# EAGLE design td1208-breakout3V3_v1.1 (EAGLE 7.2.0)
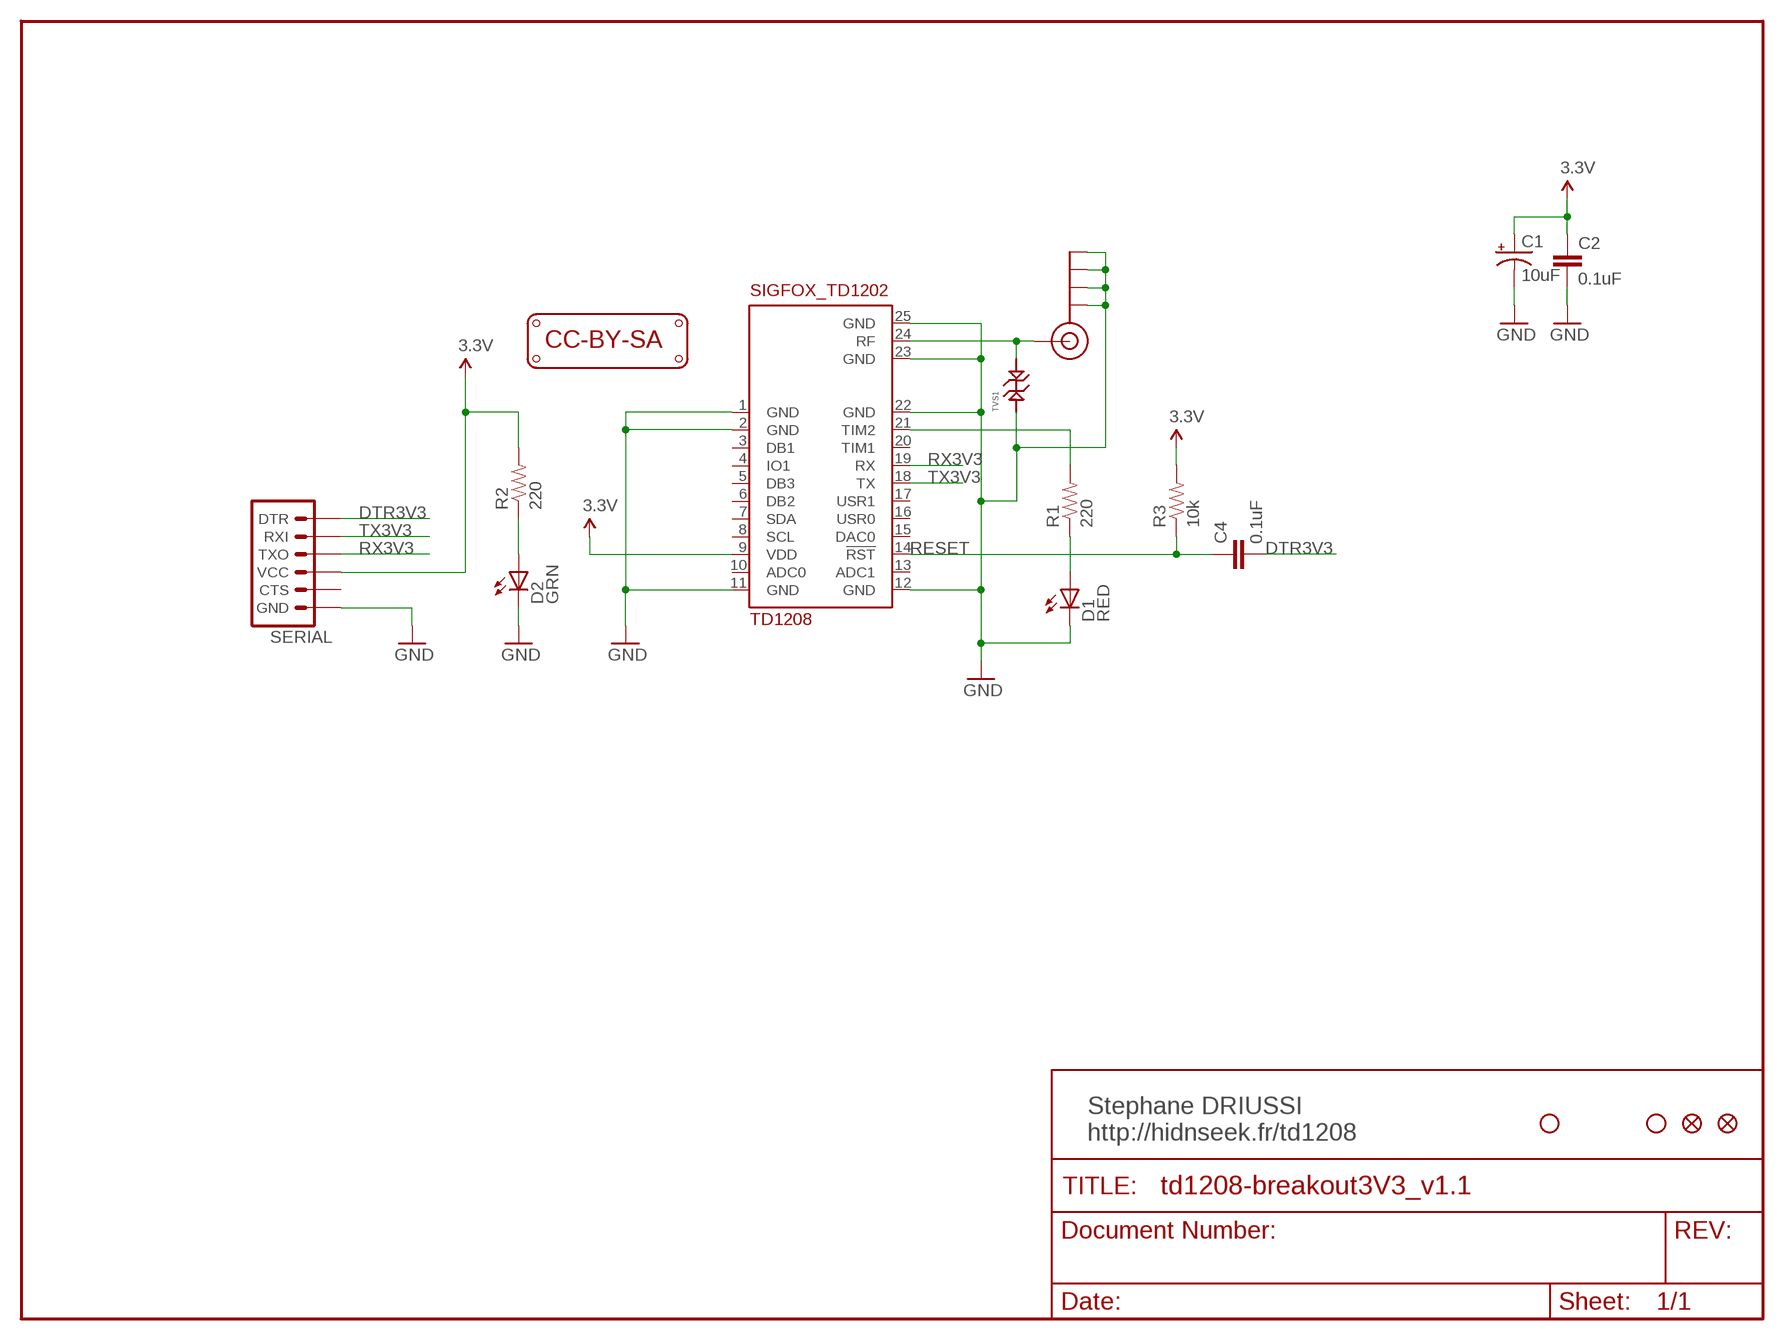
[diagram p0: schematic, sheet 1]

## Parts
C1  10uF  CAP_POL1206  [EIA3216]
C2  0.1uF  CAP0402-CAP  [0402-CAP]
C4  0.1uF  CAP0402-CAP  [0402-CAP]
D1  RED  LEDCHIP-LED0603  [CHIP-LED0603]
D2  GRN  LEDCHIP-LED0603  [CHIP-LED0603]
J$1  SMA_EDGE  [SMA_EDGE]
LOGO1  LOGO_CC-BY-SA  [LOGO_CC-BY-SA]
R1  220  RESISTOR0402-RES  [0402-RES]
R2  220  RESISTOR0402-RES  [0402-RES]
R3  10k  RESISTOR0402-RES  [0402-RES]
SERIAL  ARDUINO_SERIAL_PROGRAMPTH  [1X06]
TD1208  SIGFOX_TD1202  [TD1202]
TVS1  TVS_DIODESOD-923  [SOD-923]
U$5  STAND-OFF  [STAND-OFF]
U$7  FIDUCIAL1X2  [FIDUCIAL-1X2]
U$11  STAND-OFF  [STAND-OFF]
U$16  FIDUCIAL1X2  [FIDUCIAL-1X2]

## Nets
3.3V [vcc]: C1.A(+) C2.1 R2.2 R3.2 SERIAL.4(VCC) TD1208.9(VDD)
DTR3V3: C4.2 SERIAL.1(DTR)
GND [vcc]: C1.C(-) C2.2 D1.C D2.C J$1.GND@0(GND) J$1.GND@1(GND) J$1.GND@2(GND) J$1.GND@3(GND) SERIAL.6(GND) TD1208.1(GND) TD1208.2(GND) TD1208.11(GND) TD1208.12(GND) TD1208.22(GND) TD1208.23(GND) TD1208.25(GND) TVS1.P$1
N$1: D2.A R2.1
N$2: J$1.SIG(SIGNAL) TD1208.24(RF) TVS1.P$2
N$3: R1.2 TD1208.21(TIM2)
N$4: D1.A R1.1
RESET: C4.1 R3.1 TD1208.14(!RST)
RX3V3: SERIAL.3(TXO) TD1208.19(RX)
TX3V3: SERIAL.2(RXI) TD1208.18(TX)
Unconnected: SERIAL.5(CTS) TD1208.3(DB1) TD1208.4(IO1) TD1208.5(DB3) TD1208.6(DB2) TD1208.7(SDA) TD1208.8(SCL) TD1208.10(ADC0) TD1208.13(ADC1) TD1208.15(DAC0) TD1208.16(USR0) TD1208.17(USR1) TD1208.20(TIM1)

## Notes on the sheet
- Stephane DRIUSSI
  http://hidnseek.fr/td1208

## Library data of the parts
C1 = SparkFun:CAP_POL: Capacitor Polarized These are standard SMD and PTH capacitors. Normally 10uF, 47uF, and 100uF in electrolytic and tantalum varieties. Always verify the external diameter of the through hole cap, it varies with capacity, voltage, and manufacturer. The EIA devices should be standard.; MOUSER#: 74-293D106X96R3A2TE3
C2 C4 = SparkFun:CAP: Capacitor Standard 0603 ceramic capacitor, and 0.1" leaded capacitor.; MOUSER#: 81-GRM155R60J104KA1D
D1 D2 = adafruit:LED: LED OSRAM: - CHIPLED LG R971, LG N971, LY N971, LG Q971, LY Q971, LO R971, LY R971 LH N974, LH R974 LS Q976, LO Q976, LY Q976 LO Q996 - Hyper CHIPLED LW Q18S LB Q993, LB Q99A, LB R99A - SideLED LS A670, LO A670, LY A670, LG A670, LP A670 LB A673, LV A673, LT A673, LW A673 LH A674 LY A675 LS A676, LA A676, LO A676, LY A676, LW A676 LS A679, LY A679, LG A679 - Hyper Micro SIDELED® LS Y876, LA Y876, LO Y876, LY Y876 LT Y87S - SmartLED LW L88C, LW L88S LB L89C, LB L89S, LG L890 LS L89K, LO L89K, LY L89K LS L896, LA L896, LO L896, LY L896 - TOPLED LS T670, LO T670, LY T670, LG T670, LP T670 LSG T670, LSP T670, LSY T670, LOP T670, LYG T670 LG T671, LOG T671, LSG T671 LB T673, LV T673, LT T673, LW T673 LH T674 LS T676, LA T676, LO T676, LY T676, LB T676, LH T676, LSB T676, LW T676 LB T67C, LV T67C, LT T67C, LS T67K, LO T67K, LY T67K, LW E67C LS E67B, LA E67B, LO E67B, LY E67B, LB E67C, LV E67C, LT E67C LW T67C LS T679, LY T679, LG T679 LS T770, LO T770, LY T770, LG T770, LP T770 LB T773, LV T773, LT T773, LW T773 LH T774 LS E675, LA E675, LY E675, LS T675 LS T776, LA T776, LO T776, LY T776, LB T776 LHGB T686 LT T68C, LB T68C - Hyper Mini TOPLED® LB M676 - Mini TOPLED Santana® LG M470 LS M47K, LO M47K, LY M47K Source: http://www.osram.convergy.de/
J$1 = droneRescueAkeru_Beta_3.2:SMA_EDGE: SMA Antenna Connector End launch SMA connector. The paste layer has been removed so that the connector can be hand soldered onto the board after reflow.
LOGO1 = dp_devices:LOGO_CC-BY-SA
R1-R3 = SparkFun:RESISTOR: Resistor Basic schematic elements and footprints for 0603, 1206, and PTH 1/10th watt (small) resistors.
SERIAL = SparkFun:ARDUINO_SERIAL_PROGRAM
TD1208 = droneRescueAkeru_Beta_3.2:SIGFOX_TD1202: Telecom Design SIGFOX TD1202 - 868MHz
TVS1 = PP_Passives:TVS_DIODE
U$5 U$11 = SparkFun:STAND-OFF: Stand Off This is the mechanical footprint for a #4 phillips button head screw. Use the keepout ring to avoid running the screw head into surrounding components. SKU : PRT-00447
U$7 U$16 = SparkFun:FIDUCIAL: Fiducial Alignment Points Various fiducial points for machine vision alignment.

## Net classes
0 default: width 0.203 mm
1 vcc: width 0.305 mm
2 gnd: width 0.254 mm

## Board
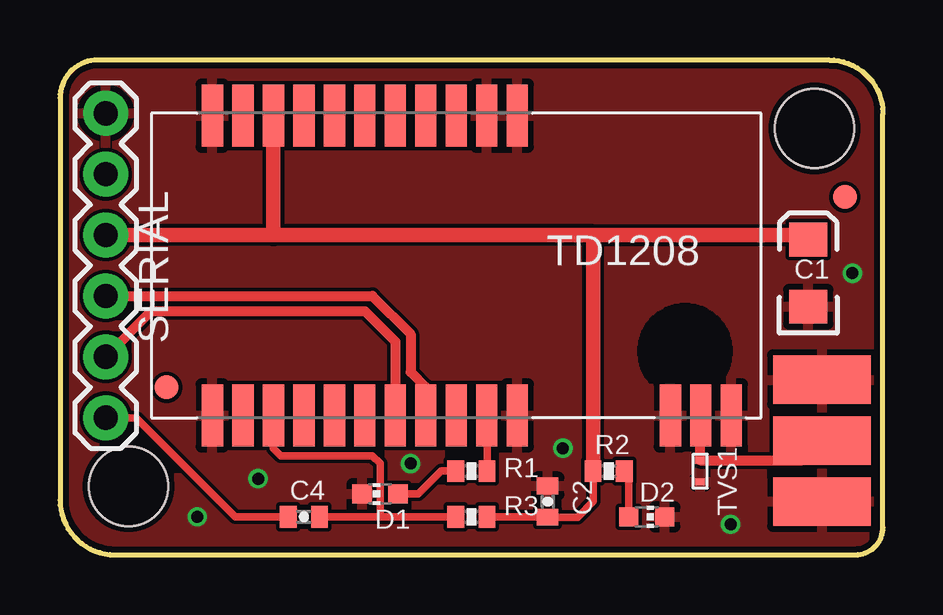
[diagram p1: board, top side]
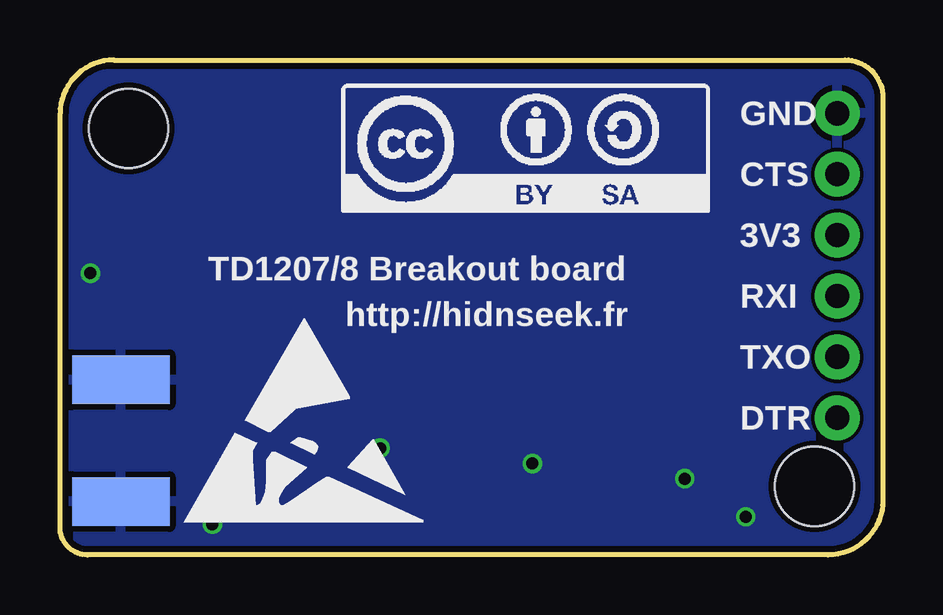
[diagram p2: board, bottom side, seen from below]

Size 34.29 x 20.64 mm. Coordinates in mm from the lower left corner, seen from the top.
Outline: 32.05,20.64 1.59,20.64 arc90 0,19.05 0,2.29 arc90 2.29,0 33.15,0 arc90 34.29,1.15 34.29,18.39 arc90 32.05,20.64
Copper layers (1*16): Top 0.035mm / dielectric 1.5mm / Bottom 0.035mm
Design rules "Elecrow_2-layer_eagle_rule": minimum track width 6mil, minimum drill 12mil, track to track 6mil, track to pad 6mil, pad to pad 6mil, via to via 6mil, smd to smd 0mil, copper to edge 10mil, drill to drill 10mil, minimum pad ring 10mil, minimum via ring 6mil, stop-mask expansion 2mil, vias tented up to drill 100mil, thermal gap 10mil

### Footprints (pad centres in the part's own frame; a part is rotated, then mirrored left to right if it is on the bottom)
EIA3216 = smd 1.4 x 1.6: A 1.4,0; C -1.4,0
0402-CAP = smd 0.7 x 0.9: 1 -0.65,0; 2 0.65,0
CHIP-LED0603 = smd 0.8 x 0.8: A 0,-0.75; C 0,0.75
SMA_EDGE = smd 2.032 x 4.064: GND@0 0,0; GND@1 5.08,0; SIG 2.54,0 | smd 2.032 x 4.064 bottom: GND@2 0,0; GND@3 5.08,0
0402-RES = smd 0.7 x 0.9: 1 -0.65,0; 2 0.65,0
1X06 = drill 1.016 pad 1.88: 1 0,0; 2 2.54,0; 3 5.08,0; 4 7.62,0; 5 10.16,0; 6 12.7,0
TD1202 = smd 0.89 x 2.6: 1 -2.54,-6.25; 2 -1.27,-6.25; 3 0,-6.25; 4 1.27,-6.25; 5 2.54,-6.25; 6 3.81,-6.25; 7 5.08,-6.25; 8 6.35,-6.25; 9 7.62,-6.25; 10 8.89,-6.25; 11 10.16,-6.25; 12 10.16,6.25; 13 8.89,6.25; 14 7.62,6.25; 15 6.35,6.25; 16 5.08,6.25; 17 3.81,6.25; 18 2.54,6.25; 19 1.27,6.25; 20 0,6.25; 21 -1.27,6.25; 22 -2.54,6.25; 23 -8.92,6.25; 24 -10.19,6.25; 25 -11.46,6.25
SOD-923 = smd 0.3 x 0.4: P$1 -0.45,0; P$2 0.45,0
STAND-OFF = hole 3.302: 0,0
FIDUCIAL-1X2 = smd 1 x 1: 1 0,0

### Placement (x,y rotation side)
C1  31.18,11.75 90 top
C2  20.32,2.22 90 top
C4  10.16,1.59 180 top
D1  13.34,2.54 90 top
D2  24.45,1.59 270 top
J$1  31.75,7.3 270 top
LOGO1  22.54,14.29 0 bottom
R1  17.14,3.49 0 top
R2  22.86,3.49 180 top
R3  17.14,1.59 0 top
SERIAL  1.91,5.71 90 top
TD1208  16.51,12.06 180 top
TVS1  26.67,3.49 90 top
U$1  [ESD_10.00]  29.21,1.27 0 bottom
U$5  2.86,2.86 0 top
U$7  32.7,14.92 0 top
U$11  31.43,17.78 0 top
U$16  4.45,6.99 0 top

### Tracks (layer width: path | path; a pad name or v marks a point on that pad's centre or on a via)
3.3V
  Top 0.305: R3.2 20.3,1.59 | C2.1 21.57,1.57 22.23,2.22 22.23,3.49 R2.2
  Top 0.406: 20.3,1.59 C2.1 | 31.37,13.34 C1.A
  Top 0.61: TD1208.9 8.89,13.34 | 8.89,13.34 SERIAL.4 | 22.23,3.49 22.23,13.34 | 22.23,13.34 8.89,13.34 | 22.23,13.34 31.37,13.34
DTR3V3
  Top 0.305: C4.2 7.3,1.59 3.17,5.71 SERIAL.1
GND  (via drill 0.5)
  other vias: 5.71,1.59 8.26,3.17 20.95,4.45 27.94,1.27 14.61,3.81 33.02,11.75
  pour Top: 0,20.32 34.29,20.32 34.29,0 0,0
  pour Bottom: 0,20.32 34.29,20.32 34.29,0 0,0
N$1
  Top 0.305: R2.1 23.7,3.49 D2.A
N$2
  Top 0.406: TD1208.24 26.67,5.79 TVS1.P$2 30.93,3.94 J$1.SIG
N$3
  Top 0.305: R1.2 17.8,5.8
  Top 0.406: 17.8,5.8 TD1208.21
N$4
  Top 0.305: D1.A 14.92,2.54 15.88,3.49 R1.1
RESET
  Top 0.305: C4.1 13.34,1.59 | 13.34,1.59 R3.1 | TD1208.14 8.89,4.45 9.21,4.13 13.02,4.13 13.34,3.81 13.34,1.59
RX3V3
  Top 0.406: SERIAL.3 13.02,10.79 14.61,9.21 14.61,7.62 15.24,6.99 TD1208.19
TX3V3
  Top 0.406: SERIAL.2 3.81,10.16 12.7,10.16 13.97,8.89 TD1208.18

### Text on the board
bPlace: GND | CTS | 3V3 | TD1207/8 Breakout board | RXI | http://hidnseek.fr | TXO | DTR